# Altium schematic sheet Microcontroller.SchDoc
size A4
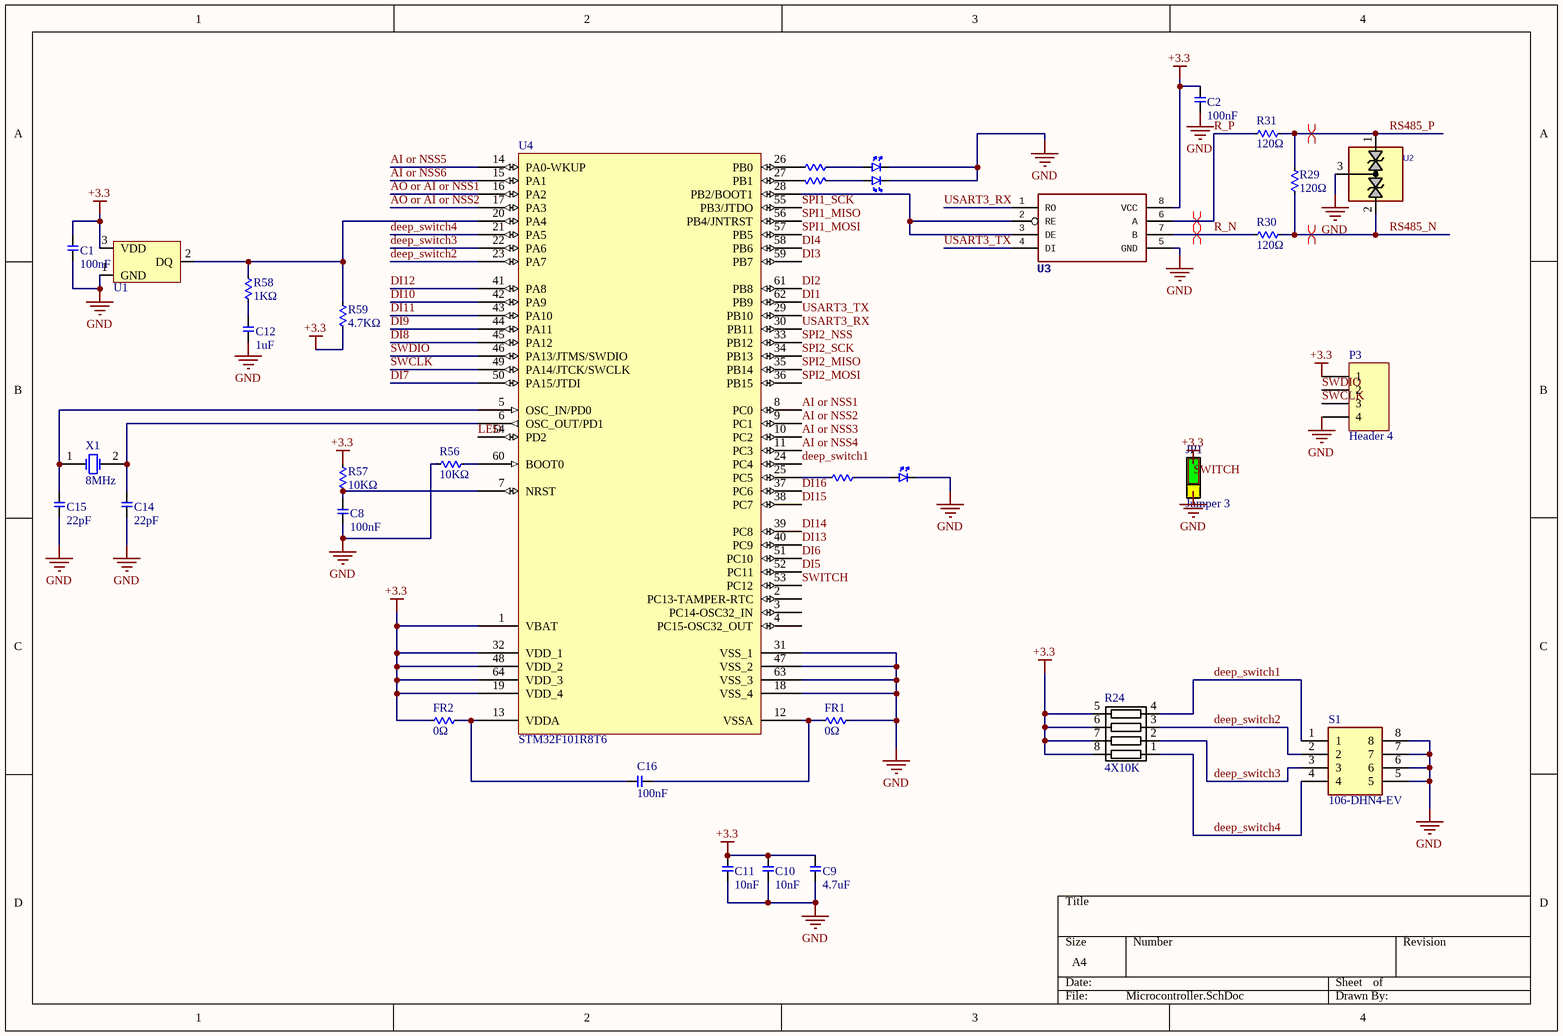
[diagram p0: Microcontroller.SchDoc]

## Parts
C1  100nF  [CAP 0603 100n]
C2  100nF  [CAP_0603]
C8  100nF  [CAP_0603]
C9  4.7uF  [CAP 0603 4.7u]
C10  10nF  [CAP 0603 10n]
C11  10nF  [CAP 0603 10n]
C12  1uF  [CAP 0603 1u]
C14  22pF  [CAP 0603 22p]
C15  22pF  [CAP 0603 22p]
C16  100nF  [CAP 0603 100n]
D1  LED  [LED 0603 RED]  (value not drawn)
D18  LED  [LED 0603 GREEN]  (value not drawn)
D19  LED  [LED 0603 GREEN]  (value not drawn)
FR1  0Ω  [RES 0603 0]
FR2  0Ω  [RES 0603 0]
JP1  Jumper 3  [Jumper 3 Blue]
P3  Header 4  [CON_MALE_4_2.54MM]
R17  100Ω  [RES 0603 100]  (value not drawn)
R18  100Ω  [RES 0603 100]  (value not drawn)
R19  100Ω  [RES 0603 100]  (value not drawn)
R24  4X10K  [RES ARRAY 4X0603 1.2K]
R29  120Ω  [RES 0603 120]
R30  120Ω  [RES 0603 120]
R31  120Ω  [RES 0603 120]
R56  10KΩ  [RES 0603 10K]
R57  10KΩ  [RES 0603 10K]
R58  1KΩ  [RES 0603]
R59  4.7KΩ  [RES 0603 4.7K]
S1  106-DHN4-EV  [dip_switch4]
U1  DS18B20  [SEMI_TO92W]  (value not drawn)
U2  CDSOT23-SM712  [SOT23_3]  (value not drawn)
U3  ADM485  [SEMI_SO8]  (value not drawn)
U4  STM32F101R8T6  [LQFP64_N]
X1  value 8MHz  [XTAL_HC49S]  (hidden comment: Xtal)

## Nets
+3.3: C1.1 C2.1 C9.1 C10.1 C11.1 FR2.1 JP1.1 P3.1 R24.5 R24.6 R24.7 R24.8 R57.1 R59.2 U1.3(VDD) U3.8(VCC) U4.1(VBAT) U4.19(VDD_4) U4.32(VDD_1) U4.48(VDD_2) U4.64(VDD_3)
GND: C1.2 C2.2 C8.2 C9.2 C10.2 C11.2 C12.2 C14.2 C15.2 D1.2 D18.2 D19.2 FR1.2 JP1.3 P3.4 R56.1 S1.5 S1.6 S1.7 S1.8 U1.1(GND) U2.3(NC) U3.5(GND) U4.18(VSS_4) U4.31(VSS_1) U4.47(VSS_2) U4.63(VSS_3)
AI or NSS1: U4.8(PC0)
AI or NSS2: U4.9(PC1)
AI or NSS3: U4.10(PC2)
AI or NSS4: U4.11(PC3)
AI or NSS5: U4.14(PA0-WKUP)
AI or NSS6: U4.15(PA1)
AO or AI or NSS1: U4.16(PA2)
AO or AI or NSS2: U4.17(PA3)
deep_switch1: R24.4 S1.1 U4.24(PC4)
deep_switch2: R24.3 S1.2 U4.23(PA7)
deep_switch3: R24.2 S1.3 U4.22(PA6)
deep_switch4: R24.1 S1.4 U4.21(PA5)
DI1: U4.62(PB9)
DI2: U4.61(PB8)
DI3: U4.59(PB7)
DI4: U4.58(PB6)
DI5: U4.52(PC11)
DI6: U4.51(PC10)
DI7: U4.50(PA15/JTDI)
DI8: U4.45(PA12)
DI9: U4.44(PA11)
DI10: U4.42(PA9)
DI11: U4.43(PA10)
DI12: U4.41(PA8)
DI13: U4.40(PC9)
DI14: U4.39(PC8)
DI15: U4.38(PC7)
DI16: U4.37(PC6)
LED: U4.54(PD2)
R_N: R30.1 U3.7(B)
R_P: R31.1 U3.6(A)
RS485_N: R29.2 R30.2 U2.2(GND)
RS485_P: R29.1 R31.2 U2.1(NC)
SPI1_MISO: U4.56(PB4/JNTRST)
SPI1_MOSI: U4.57(PB5)
SPI1_SCK: U4.55(PB3/JTDO)
SPI2_MISO: U4.35(PB14)
SPI2_MOSI: U4.36(PB15)
SPI2_NSS: U4.33(PB12)
SPI2_SCK: U4.34(PB13)
SWCLK: P3.3 U4.49(PA14/JTCK/SWCLK)
SWDIO: P3.2 U4.46(PA13/JTMS/SWDIO)
SWITCH: JP1.2 U4.53(PC12)
USART3_RX: U3.1(RO) U4.30(PB11)
USART3_TX: U3.4(DI) U4.29(PB10)
NetC8_1: C8.1 R57.2 U4.7(NRST)
NetC12_1: C12.1 R58.2
NetC14_1: C14.1 U4.6(OSC_OUT/PD1) X1.2(OSC2)
NetC15_1: C15.1 U4.5(OSC_IN/PD0) X1.1(OSC1)
NetC16_1: C16.1 FR2.2 U4.13(VDDA)
NetC16_2: C16.2 FR1.1 U4.12(VSSA)
NetD1_1: D1.1 R17.1
NetD18_1: D18.1 R18.1
NetD19_1: D19.1 R19.1
NetR17_2: R17.2 U4.27(PB1)
NetR18_2: R18.2 U4.26(PB0)
NetR19_2: R19.2 U4.25(PC5)
NetR56_2: R56.2 U4.60(BOOT0)
NetR58_1: R58.1 R59.1 U1.2(DQ) U4.20(PA4)
NetU3_2: U3.2(RE) U3.3(DE) U4.28(PB2/BOOT1)

Not connected (* = marked no-connect by the designer): U4 2(PC13-TAMPER-RTC) 3(PC14-OSC32_IN) 4(PC15-OSC32_OUT)

## Layout directives
differential pair: R_N, R_P, RS485_N, RS485_P

## Library data of the parts
C1 C2 C8 C16 = CAP 100nF
C9 = CAP 4.7uF
C10 C11 = CAP 10nF
C12 = CAP 1UF
C14 C15 = CAP 22pF
FR1 FR2 = RES 0
P3 = Header 4: Header, 4-Pin; LatestRevisionDate: 17-Jul-2002; LatestRevisionNote: Re-released for DXP Platform.; Publisher: Altium Limited
R17-R19 = RES 100
R24 = ARRAY4-10K-BOURNS: GENERIC RESISTOR ARRAY 4X INDEPENDENT; Reel: RA4
R29-R31 = RES 120
R56 R57 = RES 10K
R58 = RES
R59 = RES 4.7K
S1 = 106-DHN4-EV: Switch; Manufacturer_Name: Mountain Switch; Datasheet Link: https://componentsearchengine.com/Datasheets/1/106-DHN4-EV.pdf; Height: 1.55mm; Manufacturer_Part_Number: 106-DHN4-EV; Arrow Part Number: 106-DHN4-EV; Mouser Part Number: 106-DHN4-EV; Mouser Price/Stock: https://www.mouser.com/Search/Refine.aspx?Keyword=106-DHN4-EV
U2 = TVS_X2_CDSOT23-SM712: TVS, ESD PROTECT, 2CH, 400W/17A PP, 7.5VBR, ±8KV ESDmin; MANF: Bourns; PARAM: 400W/17A peak-pulse; MANF_P#: CDSOT23-SM712; PARAM2: 7.5VBR, ±8KV ESD min; PRICE: 1.6$; VALUE: CDSOT23-SM712
U4 = STM32F101R8T6: STM32 ARM-based 32-bit MCU with 64 Kbytes Flash, 64-pin LQFP, Industrial Temperature; Published: 30-May-2008; DatasheetVersion: rev6, Mar-2008; PackageVersion: Mar-2008; PackageReference: LQFP64; Publisher: Altium Limited; PackageDescription: 64-Pin Low-Profile Quad Flat Pack, 10 x 10 mm Body, 0.5 mm Pitch (LQFP64); ComponentLink1Description: Manufacturer Link; ComponentLink1URL: www.st.com/stm32; ComponentLink2Description: Datasheet; ComponentLink2URL: http://www.st.com/stonline/products/literature/ds/13586.pdf